# EAGLE design electrical_circut_clock (EAGLE 9.6.2)
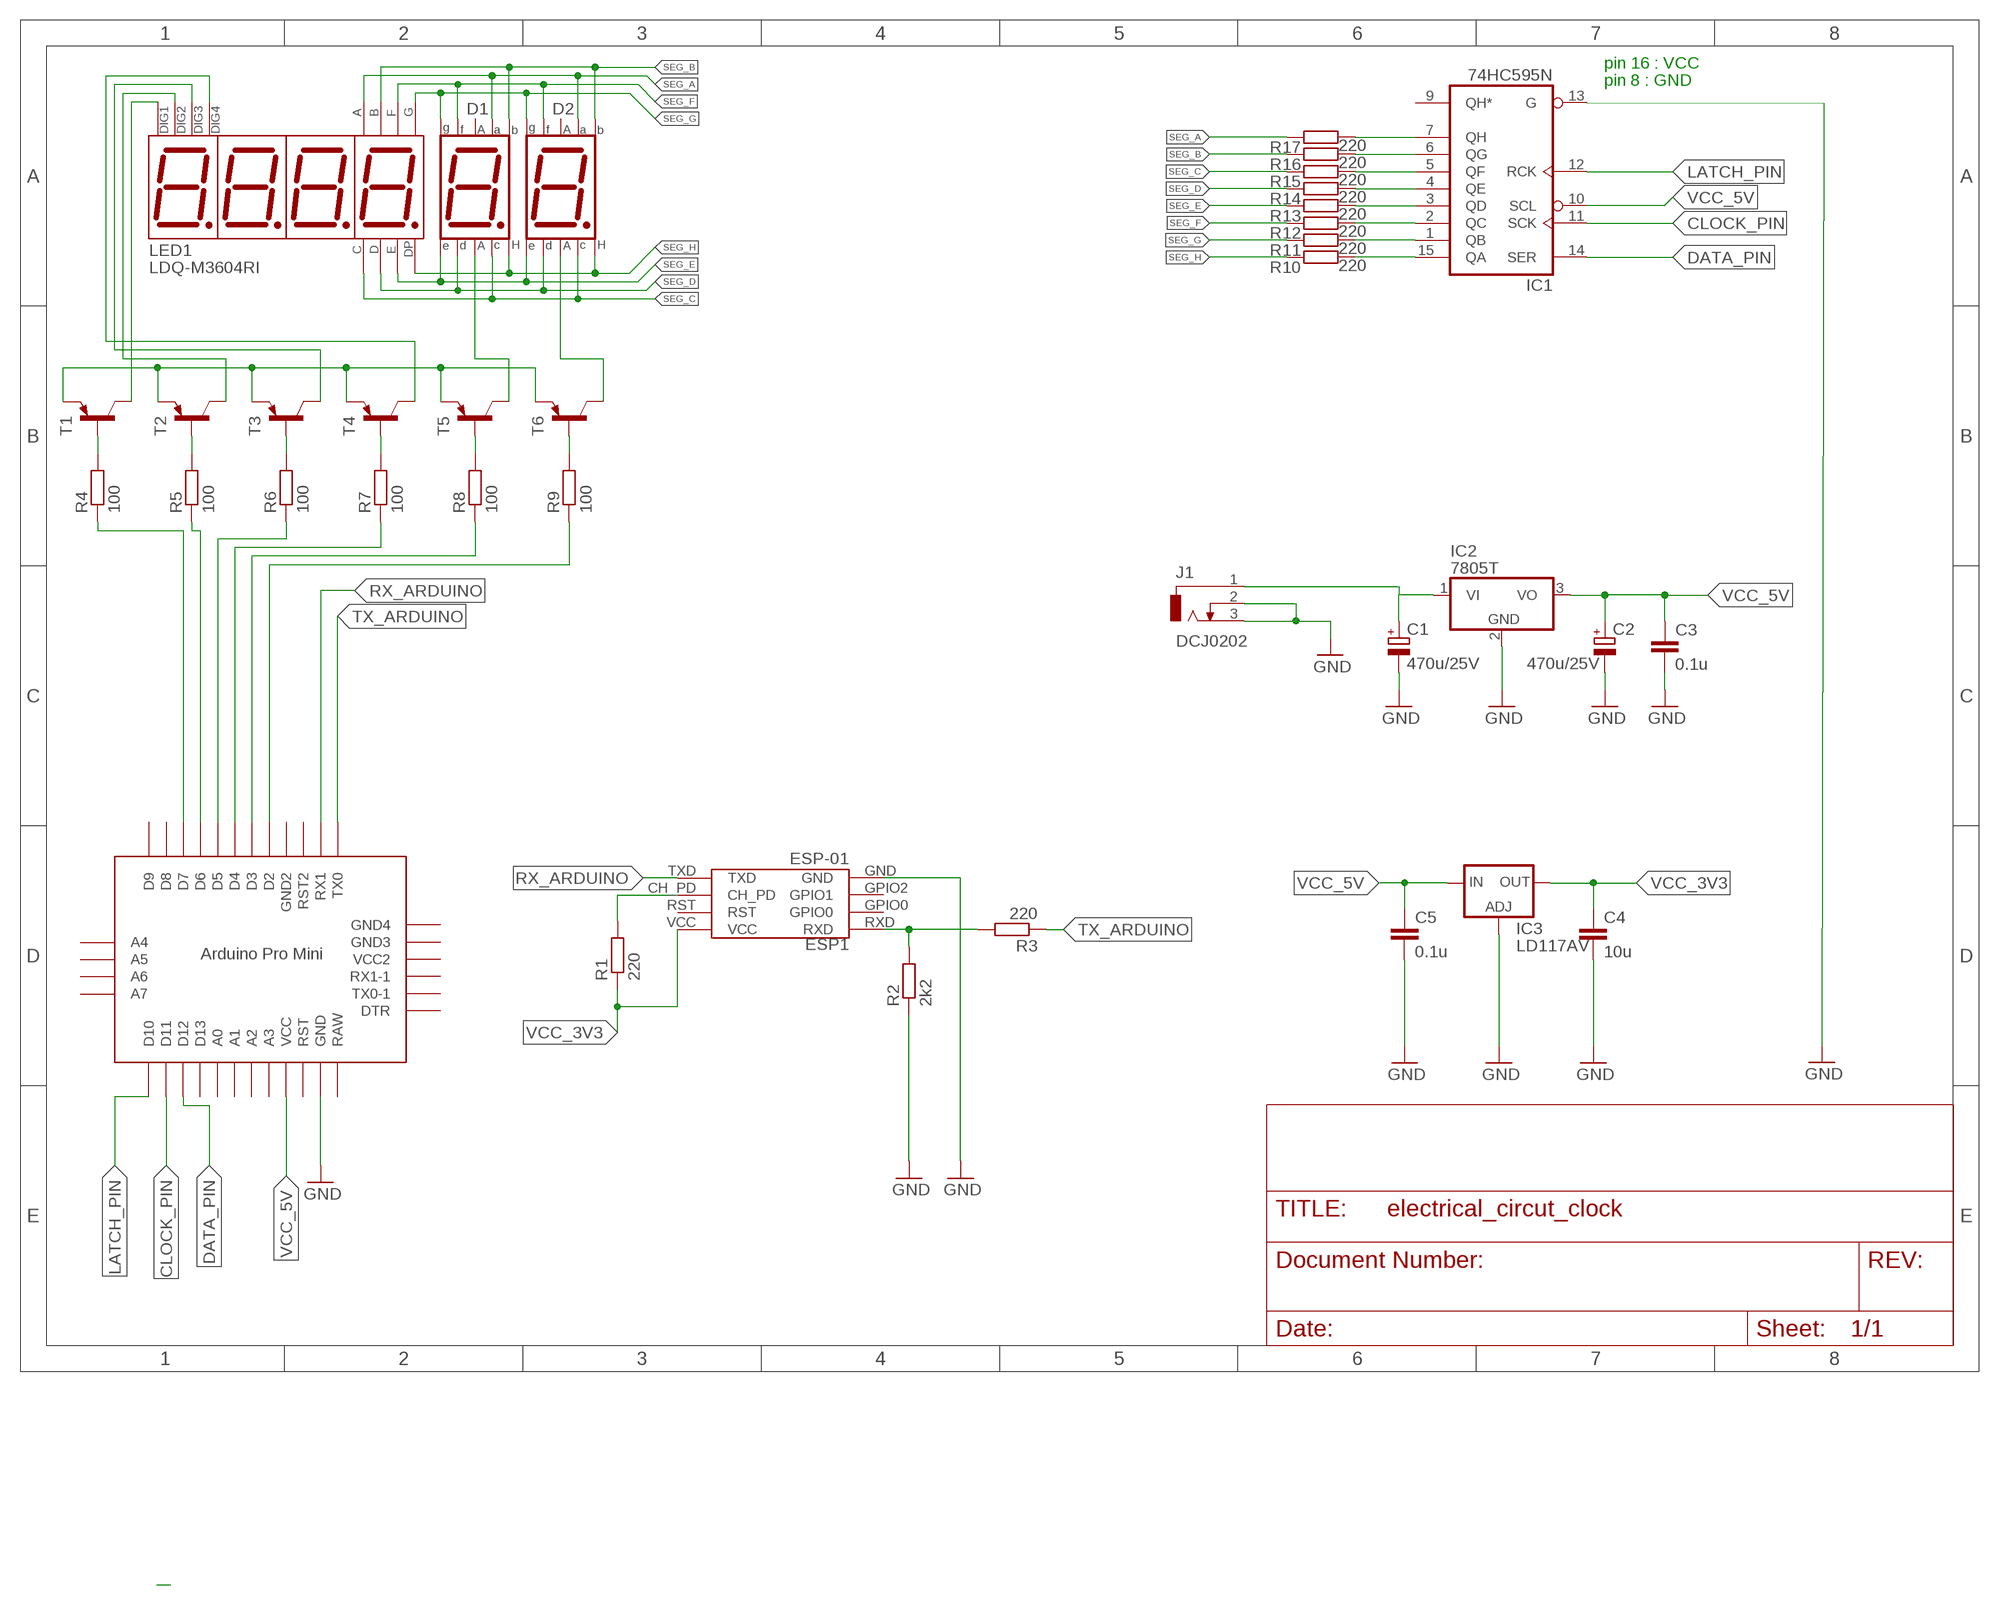
[diagram p0: schematic, sheet 1]

## Parts
C1  470u/25V  CPOL-EUE5-8.5  [E5-8,5]
C2  470u/25V  CPOL-EUE5-8.5  [E5-8,5]
C3  0.1u  C-EU025-025X050  [C025-025X050]
C4  10u  C-EU025-025X050  [C025-025X050]
C5  0.1u  C-EU025-025X050  [C025-025X050]
D1  7SEG-CA  [7SEG-13]
D2  7SEG-CA  [7SEG-13]
ESP1  ESP-01  [ESP-01]
IC1  74HC595N  [DIL16]
IC2  7805T  [TO220H]
IC3  LD117AV  [TO220L1]
J1  DCJ0202  [DCJ0202]
LED1  LDQ-M3604RI  [LDQ-M3604RI]
R1  220  R-EU_0204/7  [0204/7]
R2  2k2  R-EU_0204/7  [0204/7]
R3  220  R-EU_0204/7  [0204/7]
R4  100  R-EU_0204/7  [0204/7]
R5  100  R-EU_0204/7  [0204/7]
R6  100  R-EU_0204/7  [0204/7]
R7  100  R-EU_0204/7  [0204/7]
R8  100  R-EU_0204/7  [0204/7]
R9  100  R-EU_0204/7  [0204/7]
R10  220  R-EU_0204/7  [0204/7]
R11  220  R-EU_0204/7  [0204/7]
R12  220  R-EU_0204/7  [0204/7]
R13  220  R-EU_0204/7  [0204/7]
R14  220  R-EU_0204/7  [0204/7]
R15  220  R-EU_0204/7  [0204/7]
R16  220  R-EU_0204/7  [0204/7]
R17  220  R-EU_0204/7  [0204/7]
T1  BC556A-PNP-TO92-EBC  [TO92-EBC]
T2  BC556A-PNP-TO92-EBC  [TO92-EBC]
T3  BC556A-PNP-TO92-EBC  [TO92-EBC]
T4  BC556A-PNP-TO92-EBC  [TO92-EBC]
T5  BC556A-PNP-TO92-EBC  [TO92-EBC]
T6  BC556A-PNP-TO92-EBC  [TO92-EBC]
U$1  PRO-MINI  [PRO-MINI]

## Nets
CLOCK_PIN: IC1.11(SCK) U$1.D11
DATA_PIN: IC1.14(SER) U$1.D12
GND: C1.- C2.- C3.2 C4.2 C5.2 ESP1.GND IC1.13(G) IC2.2(GND) IC3.1(ADJ) J1.2 J1.3 R2.1 U$1.GND
LATCH_PIN: IC1.12(RCK) U$1.D10
N$1: R4.2 T1.B
N$2: R5.2 T2.B
N$3: R6.2 T3.B
N$4: R7.2 T4.B
N$5: R8.2 T5.B
N$6: R9.2 T6.B
N$7: T1.E T2.E T3.E T4.E T5.E T6.E
N$8: LED1.9(DIG2) T2.C
N$9: R4.1 U$1.D7
N$10: ESP1.CH_PD R1.2
N$12: IC1.15(QA) R10.2
N$13: IC1.1(QB) R11.2
N$14: IC1.2(QC) R12.2
N$15: IC1.3(QD) R13.2
N$16: IC1.4(QE) R14.2
N$17: IC1.5(QF) R15.2
N$18: IC1.6(QG) R16.2
N$19: IC1.7(QH) R17.2
N$26: LED1.12(DIG1) T1.C
N$27: LED1.8(DIG3) T3.C
N$28: LED1.6(DIG4) T4.C
N$29: D1.8(CA2) T5.C
N$30: D2.8(CA2) T6.C
N$32: R5.1 U$1.D6
N$33: R6.1 U$1.D5
N$34: R7.1 U$1.D4
N$35: R8.1 U$1.D3
N$36: R9.1 U$1.D2
RX_ARDUINO: ESP1.TXD U$1.RX1
SEG_A: D1.7(A) D2.7(A) LED1.11(A) R17.1
SEG_B: D1.6(B) D2.6(B) LED1.7(B) R16.1
SEG_C: D1.4(C) D2.4(C) LED1.4(C) R15.1
SEG_D: D1.2(D) D2.2(D) LED1.2(D) R14.1
SEG_E: D1.1(E) D2.1(E) LED1.1(E) R13.1
SEG_F: D1.9(F) D2.9(F) LED1.10(F) R12.1
SEG_G: D1.10(G) D2.10(G) LED1.5(G) R11.1
SEG_H: D1.5(DP) D2.5(DP) LED1.3(DP) R10.1
TX_ARDUINO: ESP1.RXD R2.2 R3.1 R3.2 U$1.TX0
VCC_3V3: C4.1 ESP1.VCC IC3.2(OUT) R1.1
VCC_5V: C2.+ C3.1 C5.1 IC1.10(SCL) IC2.3(VO) IC3.3(IN) U$1.VCC
VIN_9V: C1.+ IC2.1(VI) J1.1
Unconnected: D1.3(CA1) D2.3(CA1) ESP1.GPIO0 ESP1.GPIO2(GPIO1) ESP1.RST IC1.9(QH*) U$1.A0 U$1.A1 U$1.A2 U$1.A3 U$1.A4 U$1.A5 U$1.A6 U$1.A7 U$1.D8 U$1.D9 U$1.D13 U$1.DTR U$1.GND1(GND2) U$1.GND2(GND4) U$1.GND3 U$1.RST U$1.RST1(RST2) U$1.RX1-1 U$1.TX0-1 U$1.VCC1(VCC2)

## Notes on the sheet
- pin 16 : VCC
- pin 8 : GND

## Power pins joined to a net without a drawn wire
GND: IC1.8(GND)
RAW: U$1.RAW
VCC: IC1.16(VCC)

## Library data of the parts
C1 C2 = rcl:CPOL-EU: POLARIZED CAPACITOR, European symbol; SPICEPREFIX: C
C3-C5 = rcl:C-EU: CAPACITOR, European symbol; SPICEPREFIX: C
D1 D2 = 7SEG-vertical:7SEG-CA: 7-segment DISPLAY single anode, 13 mm
ESP1 = ESP-01:ESP-01: Check prices <https://pricing.snapeda.com/parts/ESP-01/AI-Thinker/view-part?ref=eda>; AVAILABILITY: Not in stock; DESCRIPTION: ESP-01M ESP8266 DIP Adapter series Transceiver; 802.11 b/g/n (Wi-Fi, WiFi, WLAN) Evaluation Board; MF: AI-Thinker; MP: ESP-01; PACKAGE: Non-Standard AI-Thinker; PRICE: None
IC1 = 74xx-eu:74*595: 8-bit SHIFT REGISTER, output latch
IC2 = adafruit:78*: Positive VOLTAGE REGULATOR Added bigger pads to the TO-92 package
IC3 = v-reg:LD117A?*: Low drop fixed and adjustable positive voltage regulators 1 A Source: http://www.st.com/stonline/products/literature/ds/7194/ld1117axx.pdf
J1 = con-jack:DCJ0202: DC POWER JACK Source: DCJ0202.pdf; OC_FARNELL: unknown; OC_NEWARK: unknown
LED1 = LDQ-M3604RI:LDQ-M3604RI: Check prices <https://pricing.snapeda.com/parts/LDQ-M3604RI/Lumex/view-part?ref=eda>; AVAILABILITY: In Stock; DESCRIPTION: Display, Seven Segment, 9.2MM, Red; MF: Lumex; MP: LDQ-M3604RI; PACKAGE: None; PRICE: None
R1-R17 = rcl:R-EU_: RESISTOR, European symbol; SPICEPREFIX: R
T1-T6 = transistor:*-PNP-: PNP Transistror
U$1 = Arduino-clone:PRO-MINI: Arduion Pro Mini Clone V1.0 www.betemcu.cu

## Board
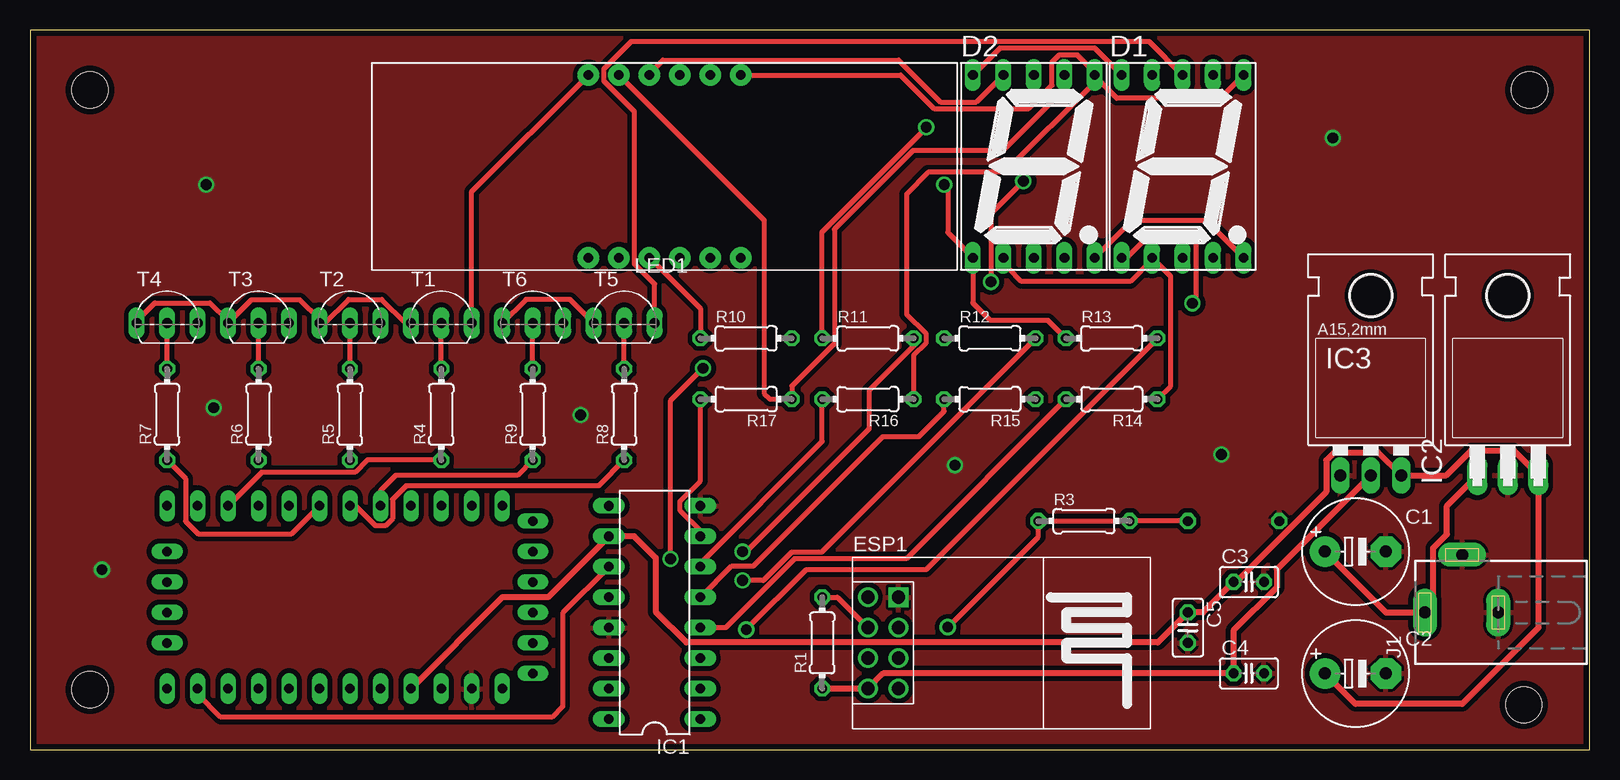
[diagram p1: board, top side]
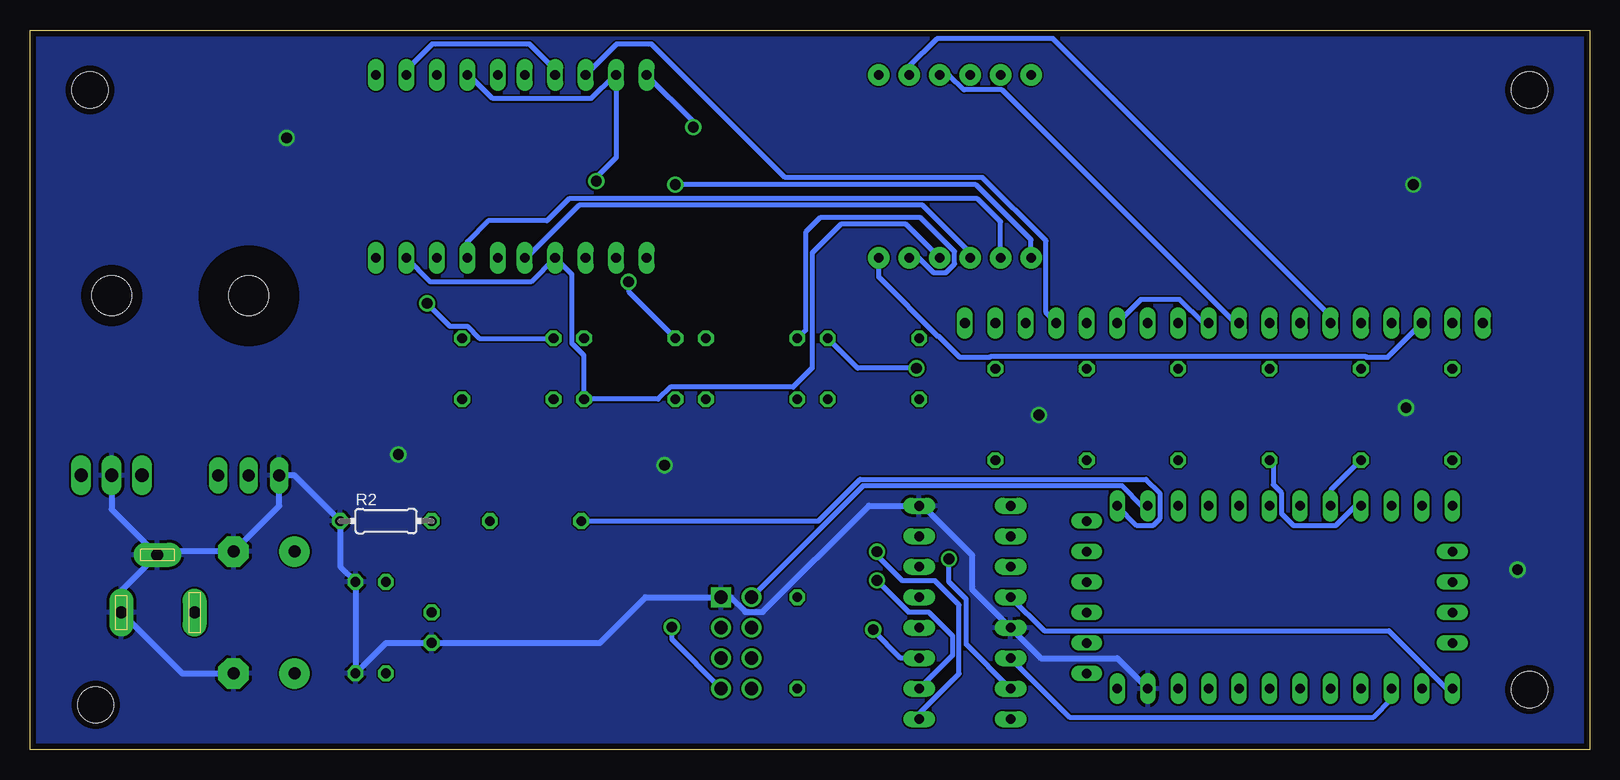
[diagram p2: board, bottom side, seen from below]

Size 130 x 60 mm. Coordinates in mm from the lower left corner, seen from the top.
Outline: 0,0 130,0 130,60 0,60 0,0
Copper layers (1*16): Top 0.035mm / dielectric 1.5mm / Bottom 0.035mm
Design rules "default *": minimum track width 6mil, minimum drill 0.35mm, track to track 6mil, track to pad 6mil, pad to pad 6mil, via to via 6mil, smd to smd 6mil, copper to edge 20mil, drill to drill 6mil, minimum pad ring 10mil, minimum via ring 8mil, stop-mask expansion 4mil, vias tented up to drill 0mil, thermal gap 10mil
Holes 3 mm at 5,5 124.52,3.73 5,55 125,55

### Footprints (pad centres in the part's own frame; a part is rotated, then mirrored left to right if it is on the bottom)
E5-8,5 = drill 1.016 pad 2.54: + -2.54,0 | drill 1.016 pad 2.54 octagon: - 2.54,0
C025-025X050 = drill 0.813 octagon: 1 -1.27,0; 2 1.27,0
7SEG-13 = drill 0.813 long: 1 -5.08,-7.62; 2 -2.54,-7.62; 3 0,-7.62; 4 2.54,-7.62; 5 5.08,-7.62; 6 5.08,7.62; 7 2.54,7.62; 8 0,7.62; 9 -2.54,7.62; 10 -5.08,7.62
ESP-01 = drill 1.1: CH_PD 1.27,1.27; GPIO0 3.81,-1.27; GPIO2 3.81,1.27; RST 1.27,-1.27; RXD 3.81,-3.81; TXD 1.27,3.81; VCC 1.27,-3.81 | drill 1.1 square: GND 3.81,3.81
DIL16 = drill 0.813 long: 1 -8.89,-3.81; 2 -6.35,-3.81; 3 -3.81,-3.81; 4 -1.27,-3.81; 5 1.27,-3.81; 6 3.81,-3.81; 7 6.35,-3.81; 8 8.89,-3.81; 9 8.89,3.81; 10 6.35,3.81; 11 3.81,3.81; 12 1.27,3.81; 13 -1.27,3.81; 14 -3.81,3.81; 15 -6.35,3.81; 16 -8.89,3.81
TO220H = drill 1.118 long: 1 -2.54,-10.16; 2 0,-10.16; 3 2.54,-10.16 | hole 3.302: 0,4.826
TO220L1 = drill 1.016 long: 1 -2.54,-3.81; 2 0,-3.81; 3 2.54,-3.81 | hole 3.302: 0,11.176
DCJ0202 = drill 1 pad 2 long: 1 0,3.1; 2 4.8,0; 3 0,-3
LDQ-M3604RI = drill 0.8 pad 1.778: 1 -6.35,-7.62; 2 -3.81,-7.62; 3 -1.27,-7.62; 4 1.27,-7.62; 5 3.81,-7.62; 6 6.35,-7.62; 7 6.35,7.62; 8 3.81,7.62; 9 1.27,7.62; 10 -1.27,7.62; 11 -3.81,7.62; 12 -6.35,7.62
0204/7 = drill 0.813 octagon: 1 -3.81,0; 2 3.81,0
TO92-EBC = drill 0.813 long: B 0,-1.27; C 2.54,-1.27; E -2.54,-1.27
PRO-MINI = drill 0.8 long: A0 8.89,8.89; A1 8.89,11.43; A2 8.89,13.97; A3 8.89,16.51; A4 -2.54,-1.27; A5 0,-1.27; A6 2.54,-1.27; A7 5.08,-1.27; D2 -6.35,16.51; D3 -6.35,13.97; D4 -6.35,11.43; D5 -6.35,8.89; D6 -6.35,6.35; D7 -6.35,3.81; D8 -6.35,1.27; D9 -6.35,-1.27; D10 8.89,-1.27; D11 8.89,1.27; D12 8.89,3.81; D13 8.89,6.35; DTR 7.62,29.21; GND 8.89,24.13; GND1 -6.35,19.05; GND2 -5.08,29.21; GND3 -2.54,29.21; RAW 8.89,26.67; RST 8.89,21.59; RST1 -6.35,21.59; RX1 -6.35,24.13; RX1-1 2.54,29.21; TX0 -6.35,26.67; TX0-1 5.08,29.21; VCC 8.89,19.05; VCC1 0,29.21

### Placement (x,y rotation side)
C1  110.49,16.51 0 top
C2  110.49,6.35 0 top
C3  101.6,13.97 0 top
C4  101.6,6.35 0 top
C5  96.52,10.16 270 top
D1  96.08,48.63 0 top
D2  83.68,48.63 0 top
ESP1  68.58,8.89 0 top
IC1  52.07,11.43 90 top
IC2  123.19,33.02 0 top
IC3  111.76,26.67 0 top
J1  119.38,11.43 90 top
LED1  52.9,48.63 0 top
R1  66.04,8.89 90 top
R2  100.33,19.05 0 bottom
R3  87.86,19.05 0 top
R4  34.29,27.94 90 top
R5  26.67,27.94 90 top
R6  19.05,27.94 90 top
R7  11.43,27.94 90 top
R8  49.53,27.94 90 top
R9  41.91,27.94 90 top
R10  59.69,34.29 0 top
R11  69.85,34.29 0 top
R12  80.01,34.29 0 top
R13  90.17,34.29 0 top
R14  90.17,29.21 180 top
R15  80.01,29.21 180 top
R16  69.85,29.21 180 top
R17  59.69,29.21 180 top
T1  34.29,36.83 0 top
T2  26.67,36.83 0 top
T3  19.05,36.83 0 top
T4  11.43,36.83 0 top
T5  49.53,36.83 0 top
T6  41.91,36.83 0 top
U$1  12.7,13.97 270 top

### Tracks (layer width: path | path; a pad name or v marks a point on that pad's centre or on a via)
CLOCK_PIN
  Top 0.4: IC1.11 44.4,11.38 44.4,3.6 43.5,2.7 15.9,2.7 13.97,4.63 U$1.D11
DATA_PIN
  Bottom 0.4: IC1.14 43.34,2.7 18,2.7 16.51,4.19 U$1.D12
GND  (via drill 0.9)
  Bottom 0.5: IC2.2 123.19,20.04 J1.2 | J1.2 122.38,13.23 J1.3 117.3,6.35 C2.- | J1.2 119.1,16.51 C1.- 109.22,20.32 IC3.1 107.95,22.86 R2.1 104.14,15.24 C3.2 C4.2 100.33,8.89 C5.2 82.5,8.89 78.69,12.7 ESP1.GND 71.59,12.7 70.36,11.47 68.93,11.47 60.08,20.32 IC1.8 55.58,20.32 51.47,16.21 51.47,13.37 IC1.13 45.72,7.62 39.37,7.62 U$1.GND
  other vias: 14.7,47.1 15.3,28.5 45.9,27.9 77.1,23.7 99.3,24.6 108.6,51 6,15
  pour Bottom: -15.3,72.3 -15.3,0.3 3.3,-18.3 162.9,-18.3 173.4,-7.8 173.4,52.5 152.7,73.2 151.2,74.7 0.3,74.7 -12.9,74.7
  pour Top (isolate 0.4): -1.2,77.7 -1.2,-16.2 3.3,-20.7 127.5,-20.7 133.2,-15 149.1,0.9 149.1,66.3 130.2,85.2 64.8,85.2 6.3,85.2
LATCH_PIN
  Bottom 0.4: U$1.D10 11.89,5.08 16.71,9.9 45.46,9.9 IC1.12
N$1
  Top 0.4: R4.2 T1.B
N$2
  Top 0.4: R5.2 T2.B
N$3
  Top 0.4: R6.2 T3.B
N$4
  Top 0.4: R7.2 T4.B
N$5
  Top 0.4: R8.2 T5.B
N$6
  Top 0.4: R9.2 T6.B
N$7
  Top 0.4: T5.E 45.02,37.53 41.34,37.53 T6.E | T4.E 8.89,35.71 10.41,37.23 14.99,37.23 16.51,35.71 T3.E 18.45,37.5 22.49,37.5 24.13,35.86 T2.E 24.58,35.56 26.55,37.53 29.33,37.53 31.3,35.56 T1.E
  Bottom 0.4: T1.E 32.2,35.56 34.17,37.53 37.4,37.53 T6.E
N$8
  Bottom 0.4: T2.C 29.51,35.56 48.96,55.01 52.14,55.01 53.39,56.25 LED1.9
N$9
  Top 0.4: U$1.D7 19.31,23.12 27.09,23.12 28.1,24.13 R4.1
N$10
  Top 0.4: R1.2 67.31,12.7 ESP1.CH_PD
N$12  (via drill 0.9)
  Top 0.4: v53.4,15.9 53.4,29.1 v56.1,31.8
  Bottom 0.4: IC1.15 51.95,8.77 51.95,12.53 53.4,13.98 v53.4,15.9 | v56.1,31.8 61.01,31.8 R10.2
N$13  (via drill 0.9)
  Top 0.4: R11.2 73.66,33.64 69.95,29.93 69.95,26.75 59.7,16.5 v59.4,16.5
  Bottom 0.4: IC1.1 55.88,2.99 52.55,6.32 52.55,12.05 54.6,14.1 57.3,14.1 59.4,16.2 v59.4,16.5
N$14  (via drill 0.9)
  Top 0.4: R12.2 65.98,16.45 63.49,16.45 61.14,14.1 v59.4,14.1
  Bottom 0.4: v59.4,14.1 56.77,11.47 55.1,11.47 53.1,9.47 53.1,7.86 IC1.2
N$15  (via drill 0.9)
  Top 0.4: R13.2 74.69,15 64.69,15 v59.7,10.01
  Bottom 0.4: IC1.3 57.42,7.62 59.7,9.9 v59.7,10.01
N$16
  Top 0.4: R14.2 73.05,15.9 63.72,15.9 57.98,10.16 IC1.4
N$17
  Top 0.4: 56.5,12.7 IC1.5 58.48,15.3 60.3,15.3 71.1,26.1 74.1,26.1 76.2,28.2 R15.2
N$18
  Top 0.4: IC1.6 55.88,15.54 66.04,25.7 R16.2
N$19
  Top 0.4: IC1.7 55.88,18.23 54.21,19.9 54.21,20.74 55.88,22.41 R17.2
N$26
  Top 0.4: T1.C 36.83,46.53 LED1.12
N$27
  Bottom 0.4: T3.C 21.59,36.16 44.72,59.29 54.38,59.29 56.71,56.97 LED1.8
N$28
  Bottom 0.4: T4.C 16.8,32.73 16.8,32.7 18.57,32.7 18.63,32.76 49.95,32.76 50.01,32.7 52.5,32.7 54.27,34.47 54.27,34.41 59.25,39.39 LED1.6
N$29
  Top 0.4: T5.C 52.07,38.81 50.39,40.5 50.39,53.2 47.85,55.74 47.85,56.76 50.14,59.05 93.28,59.05 D1.8
N$30
  Bottom 0.4: T6.C 45.31,36.42 45.31,42.42 50.58,47.7 67.06,47.7 78.18,58.82 81.11,58.82 D2.8
N$32
  Bottom 0.4: U$1.D6 19.51,20.32 21.17,18.66 24.66,18.66 25.66,19.66 25.66,21.39 26.37,22.1 26.37,23.83 R5.1
N$33
  Bottom 0.4: R6.1 21.59,21.59 U$1.D5
N$34
  Top 0.4: R7.1 12.96,22.6 12.96,19.04 14,18 21.81,18 U$1.D4
N$35
  Top 0.4: R8.1 47.4,22 31.35,22 30.22,20.86 30.22,19.25 29.63,18.66 28.79,18.66 27.13,20.32 U$1.D3
N$36
  Top 0.4: R9.1 40.64,22.86 30.48,22.86 29.21,21.59 U$1.D2
RX_ARDUINO
  Bottom 0.4: U$1.RX1 37.29,20.32 38.95,21.98 60.57,21.98 ESP1.TXD
SEG_A
  Top 0.4: LED1.11 61.2,44.14 61.2,29.7 61.69,29.21 R17.1 63.5,30.32 67.05,33.87 67.05,43.38 73.62,49.95 81.12,49.95 86.22,55.05 D2.7
  Bottom 0.4: D2.7 86.22,56.7 88.34,58.82 96.5,58.82 98.62,56.7 D1.7
SEG_B
  Top 0.4: D1.6 99.21,54.3 90.6,54.3 88.76,56.14 D2.6 | LED1.7 72.57,56.25 75.37,53.45 83.27,53.45 85.21,55.38 85.21,57.33 85.8,57.92 87.28,57.92 88.76,56.44 D2.6 | R16.1 73.66,32.86 74.67,33.87 74.67,34.71 73.07,36.31 73.07,46.33 74.87,48.13 81.24,48.13 88.76,55.65 D2.6
SEG_C
  Bottom 0.4: D1.4 96.61,39 88.23,39 D2.4 84.83,39.62 84.83,33.87 83.82,32.86 R15.1 77.63,29.21 76.62,30.22 66.38,30.22 64.8,31.8 64.8,41.4 62.4,43.8 56.96,43.8 LED1.4
SEG_D
  Top 0.4: R14.1 95.1,30.33 95.1,39.45 D1.2 93.54,40.86 91.72,39.04 82.66,39.04 81.59,40.11 81.44,40.11 81.14,40.41 D2.2
  Bottom 0.4: LED1.2 49.09,44.01 51.02,45.94 85.07,45.94 86.9,44.1 91.8,44.1 93.54,42.36 D1.2
SEG_E  (via drill 0.9)
  Top 0.4: R13.1 84.86,35.79 80.06,35.79 78.6,37.25 D2.1 76.5,43.11 76.5,46.8 v76.2,47.1 | D1.1 91.45,41.01 93.12,42.68 96.71,42.68 97.2,42.2 97.2,37.5 v96.9,37.2
  Bottom 0.4: 46.55,41.15 LED1.1 46.55,42.51 51.14,47.1 v76.2,47.1 | v96.9,37.2 95,35.3 93.56,35.3 92.55,34.29 R13.1
SEG_F  (via drill 0.9)
  Top 0.4: LED1.10 51.63,56.37 52.76,57.49 72.41,57.49 75.9,54 78.89,54 D2.9 | v82.8,47.4 80.1,44.7 v80.1,39
  Bottom 0.4: D1.9 93.39,56.25 91.42,54.28 83.26,54.28 81.29,56.25 D2.9 81.14,49.36 82.8,47.7 v82.8,47.4 | v80.1,39 80.1,38.19 R12.1
SEG_G  (via drill 0.9)
  Top 0.4: D1.10 88.75,58.5 80.85,58.5 D2.10 | R11.1 66.04,43.15 74.7,51.81 v74.7,51.9
  Bottom 0.4: R11.1 65.35,34.98 65.35,43.13 64.13,44.35 55.76,44.35 52.93,41.52 52.93,40.5 53.66,39.77 54.68,39.77 55.93,41.01 LED1.5 | v74.7,51.9 74.7,52.35 D2.10
SEG_H
  Top 0.4: LED1.3 55.88,36.76 R10.1 | D1.5 98.07,44.1 91.85,44.1 D2.5
  Bottom 0.4: LED1.3 51.63,41.43 55.59,45.38 84.24,45.38 88.61,41.01 D2.5
TX_ARDUINO  (via drill 0.9)
  Top 0.4: R2.2 R3.2 R3.1 84.05,17.75 v76.5,10.2
  Bottom 0.4: R3.1 64.28,19.05 60.8,22.53 36.97,22.53 35.82,21.39 35.82,19.25 36.41,18.66 37.71,18.66 U$1.TX0 | ESP1.RXD 76.5,9.19 v76.5,10.2
VCC_3V3
  Top 0.5: IC3.2 103.93,15.03 103.93,13.53 100.33,9.93 C4.1 71.12,6.35 ESP1.VCC R1.1
VCC_5V
  Top 0.5: 125.73,21.59 IC2.3 | C2.+ 110.49,3.81 119.38,3.81 125.73,10.16 IC2.3 | U$1.VCC 39.37,12.7 43.18,12.7 IC1.10 50.36,17.78 52.16,15.98 52.16,11.48 54.71,8.93 94.02,8.93 C5.1 97.79,11.43 C3.1 100.56,13.97 108.06,21.46 108.06,24.1 108.74,24.79 112.37,24.79 IC3.3 118.06,22.86 120.14,24.94 123.7,24.94 125.73,22.91 IC2.3
VIN_9V
  Top 0.5: C1.+ 113.03,11.43 J1.1 116.98,12.13 116.98,16.81 118.11,17.94 118.11,20.32 IC2.1